# Altium schematic sheet CONNECT.SchDoc
size A4
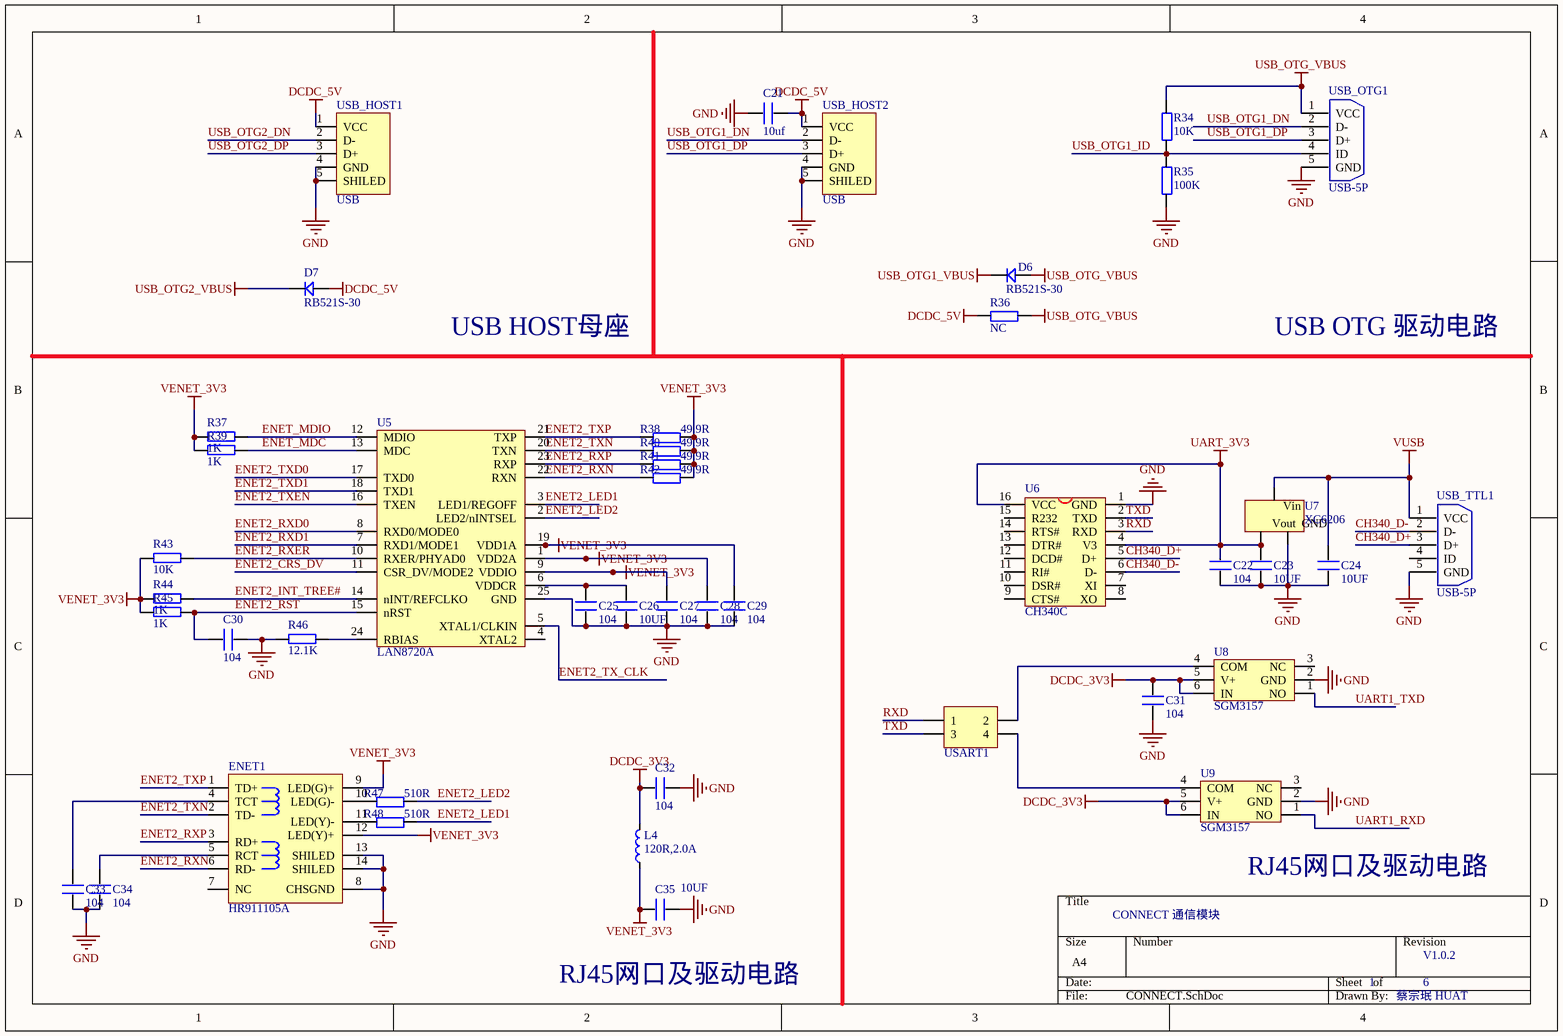
[diagram p0: CONNECT.SchDoc]

## Parts
C21  10uf  [C_0603P]
C22  104  [C_0603P]
C23  10UF  [C_0603P]
C24  10UF  [C_0603P]
C25  104  [C_0603P]
C26  10UF  [C_0603P]
C27  104  [C_0603P]
C28  104  [C_0603P]
C29  104  [C_0603P]
C30  104  [C_0603P]
C31  104  [C_0603P]
C32  104  [C_0603P]
C33  104  [C_0603P]
C34  104  [C_0603P]
C35  10UF  [C_0603P]
D6  RB521S-30  [DIODE 3*5.3]
D7  RB521S-30  [DIODE 3*5.3]
ENET1  HR911105A  [RJ-45A12]
L4  120R,2.0A  [L 0603]
R34  10K  [R_0603P]
R35  100K  [R_0603P]
R36  NC  [R_0603P]
R37  1K  [R_0603P]
R38  49.9R  [R_0603P]
R39  1K  [R_0603P]
R40  49.9R  [R_0603P]
R41  49.9R  [R_0603P]
R42  49.9R  [R_0603P]
R43  10K  [R_0603P]
R44  1K  [R_0603P]
R45  1K  [R_0603P]
R46  12.1K  [R_0603P]
R47  510R  [R_0603P]
R48  510R  [R_0603P]
U5  LAN8720A  [QFN24]
U6  CH340C  [SOP16_N]
U7  XC6206  [SOT23-3N]
U8  SGM3157  [SOT363-6L]
U9  SGM3157  [SOT363-6L]
USART1  Header2X2  [HDR-2X2]  (value not drawn)
USB_HOST1  USB  [USB-A/S_E]
USB_HOST2  USB  [USB-A/S_E]
USB_OTG1  USB-5P  [USB-MINI-A]
USB_TTL1  USB-5P  [USB-MINI-A]

## Nets
DCDC_3V3: C31.2 C32.2 L4.2 U8.5(V+) U8.6(IN) U9.5(V+) U9.6(IN)
DCDC_5V: C21.2 D7.1 R36.1 USB_HOST1.1(VCC) USB_HOST2.1(VCC)
GND: C21.1 C22.1 C23.1 C24.1 C25.1 C26.1 C27.1 C28.1 C29.1 C30.1 C31.1 C32.1 C33.1 C34.1 C35.1 ENET1.8(CHSGND) ENET1.13(SHILED) ENET1.14(SHILED) R35.1 R46.2 U5.25(GND) U6.1(GND) U7.1(GND) U8.2(GND) U9.2(GND) USB_HOST1.4(GND) USB_HOST1.5(SHILED) USB_HOST2.4(GND) USB_HOST2.5(SHILED) USB_OTG1.5(GND) USB_TTL1.5(GND)
UART_3V3: C22.2 C23.2 U6.4(V3) U6.16(VCC) U7.2(Vout)
USB_OTG1_VBUS: D6.2
USB_OTG2_VBUS: D7.2
USB_OTG_VBUS: D6.1 R34.2 R36.2 USB_OTG1.1(VCC)
VENET_3V3: C27.2 C28.2 C29.2 C35.2 ENET1.9(LED(G)+) ENET1.12(LED(Y)+) L4.1 R37.2 R38.2 R39.2 R40.2 R41.2 R42.2 R43.2 R44.2 R45.2 U5.1(VDD2A) U5.9(VDDIO) U5.19(VDD1A)
VUSB: C24.2 U7.3(Vin) USB_TTL1.1(VCC)
CH340_D+: U6.5(D+) USB_TTL1.3(D+)
CH340_D-: U6.6(D-) USB_TTL1.2(D-)
ENET2_CRS_DV: U5.11(CSR_DV/MODE2)
ENET2_INT_TREE#: R44.1 U5.14(nINT/REFCLKO)
ENET2_LED1: R48.2 U5.3(LED1/REGOFF)
ENET2_LED2: R47.2 U5.2(LED2/nINTSEL)
ENET2_RST: C30.2 R45.1 U5.15(nRST)
ENET2_RXD0: U5.8(RXD0/MODE0)
ENET2_RXD1: U5.7(RXD1/MODE1)
ENET2_RXER: R43.1 U5.10(RXER/PHYAD0)
ENET2_RXN: ENET1.6(RD-) R42.1 U5.22(RXN)
ENET2_RXP: ENET1.3(RD+) R41.1 U5.23(RXP)
ENET2_TX_CLK: U5.5(XTAL1/CLKIN)
ENET2_TXD0: U5.17(TXD0)
ENET2_TXD1: U5.18(TXD1)
ENET2_TXEN: U5.16(TXEN)
ENET2_TXN: ENET1.2(TD-) R40.1 U5.20(TXN)
ENET2_TXP: ENET1.1(TD+) R38.1 U5.21(TXP)
ENET_MDC: R39.1 U5.13(MDC)
ENET_MDIO: R37.1 U5.12(MDIO)
RXD: U6.3(RXD) USART1.1
TXD: U6.2(TXD) USART1.3
UART1_RXD: U9.1(NO)
UART1_TXD: U8.1(NO)
USB_OTG1_DN: USB_HOST2.2(D-) USB_OTG1.2(D-)
USB_OTG1_DP: USB_HOST2.3(D+) USB_OTG1.3(D+)
USB_OTG1_ID: R34.1 R35.2 USB_OTG1.4(ID)
USB_OTG2_DN: USB_HOST1.2(D-)
USB_OTG2_DP: USB_HOST1.3(D+)
NetC25_2: C25.2 C26.2 U5.6(VDDCR)
NetC33_2: C33.2 ENET1.4(TCT)
NetC34_2: C34.2 ENET1.5(RCT)
NetENET1_10: ENET1.10(LED(G)-) R47.1
NetENET1_11: ENET1.11(LED(Y)-) R48.1
NetR46_1: R46.1 U5.24(RBIAS)
NetU8_4: U8.4(COM) USART1.2
NetU9_4: U9.4(COM) USART1.4

Not connected (* = marked no-connect by the designer): ENET1 7(NC); U5 4(XTAL2); U6 7(XI) 8(XO) 9(CTS#) 10(DSR#) 11(RI#) 12(DCD#) 13(DTR#) 14(RTS#) 15(R232); U8 3(NC); U9 3(NC); USB_TTL1 4(ID)

## Notes on the sheet
- USB HOST母座
- USB OTG 驱动电路
- CONNECT 通信模块
- (near U9) RJ45网口及驱动电路
- (near C35) RJ45网口及驱动电路
- 1
- 6
- V1.0.2
- 蔡宗珉 HUAT

## Library data of the parts
C21-C35 = C
D6 D7 = D: 1N4148
ENET1 = HR911105A: 带灯以太网接口; 版权归属: 源创客; BOM名称: 带灯以太网接口; 学习资源: www.ooocke.com
L4 = L: 小功率贴片电感磁珠; 版权归属: 源创客; BOM名称: 小功率贴片电感; 学习资源: www.ooocke.com
R34-R48 = R
U5 = LAN8720: ETH PHY
U6 = CH340G: USB2UART
U7 = LDO XC6206: LDO; ComponentLink1Description: 供应商链接; ComponentLink1URL: http://www.szlcsc.com/product/details_5896.html; Package: SOT-23; Supplier: LC; SuppliersPartNumber: C5446
U8 U9 = SGM3157: 单路双掷模拟开关
USART1 = Header 2X2: 2*2P接插件; 版权归属: 源创客; BOM名称: 2*2P接插件; 学习资源: www.ooocke.com
USB_HOST1 USB_HOST2 = USB-A/S: USB-A型母接口; 版权归属: 源创客; BOM名称: USB-A型母接口; 学习资源: www.ooocke.com
USB_OTG1 USB_TTL1 = USB-5P: 微型USB母座; 版权归属: 源创客; BOM名称: 微型USB母座; 学习资源: www.ooocke.com